# EasyEDA schematic HW1_58.json
TITLE: Sheet_1; REV: 1.0; Date: 2020-11-04; Sheet: 1/1; Drawn By: gokbeykeskin_4066; Company: Your Company
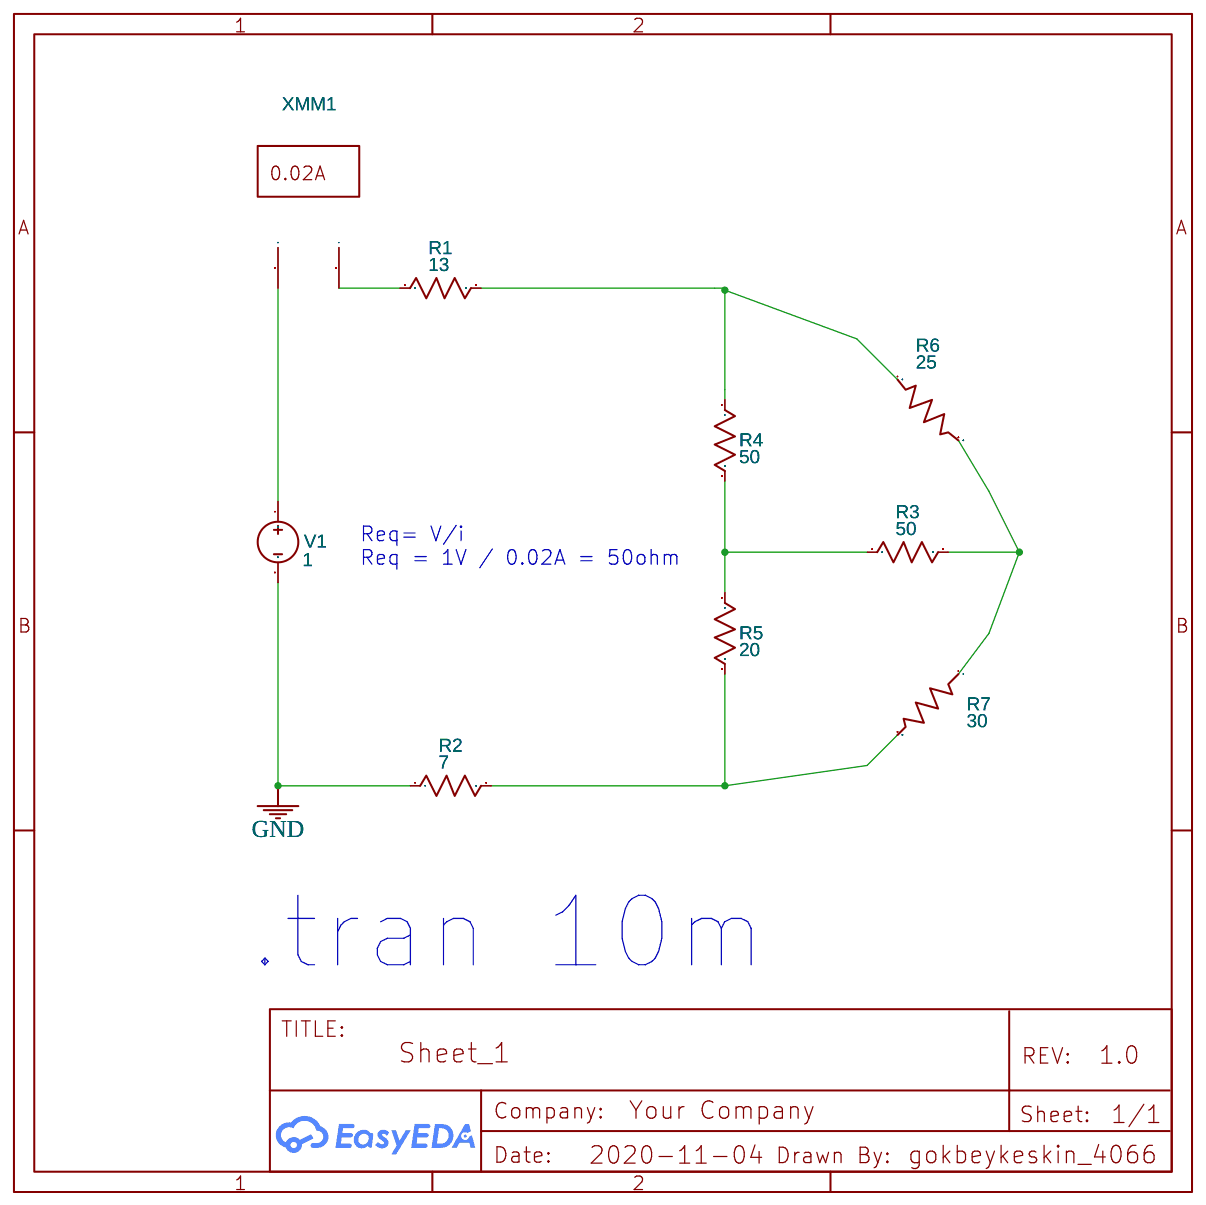
[diagram p0: schematic sheet]

## Parts
R1  13  [AXIAL-0.3]
R2  7  [AXIAL-0.3]
R3  50  [AXIAL-0.3]
R4  50  [AXIAL-0.3]
R5  20  [AXIAL-0.3]
R6  25  [AXIAL-0.3]
R7  30  [AXIAL-0.3]
V1  1  [HDR1X2]
XMM1  Multimeter

## Library data of the parts
R1-R5 = Resistor_US: Resistance: 1k; Contributor: EasyEDA; Supplier: YUJING
R6 R7 = Resistor_45Degree_US: Supplier: YUJING; Contributor: EasyEDA; Resistance: 1K
V1 = VDC: Contributor: EasyEDA; sim: true
XMM1 = MULTIMETER: Supplier: LCSC; Multimeter Type: Amper; Power Type: AC; Voltmeter resistance: 10μ; Ammeter resistance: 1G; NameDisplay: 0; Contributor: EasyEDA; sim: true

## Nets
GND: R2.1 V1.2
Net-(R1-1): R1.1 XMM1.2(I)
Net-(R1-2): R1.2 R4.1 R6.1
Net-(R2-2): R2.2 R5.2 R7.2
Net-(R3-1): R3.1 R4.2 R5.1
Net-(R3-2): R3.2 R6.2 R7.1
Net-(V1-1): V1.1 XMM1.1(+)

## Notes on the sheet
- Req= V/i
  Req = 1V / 0.02A = 50ohm
- .tran 10m
